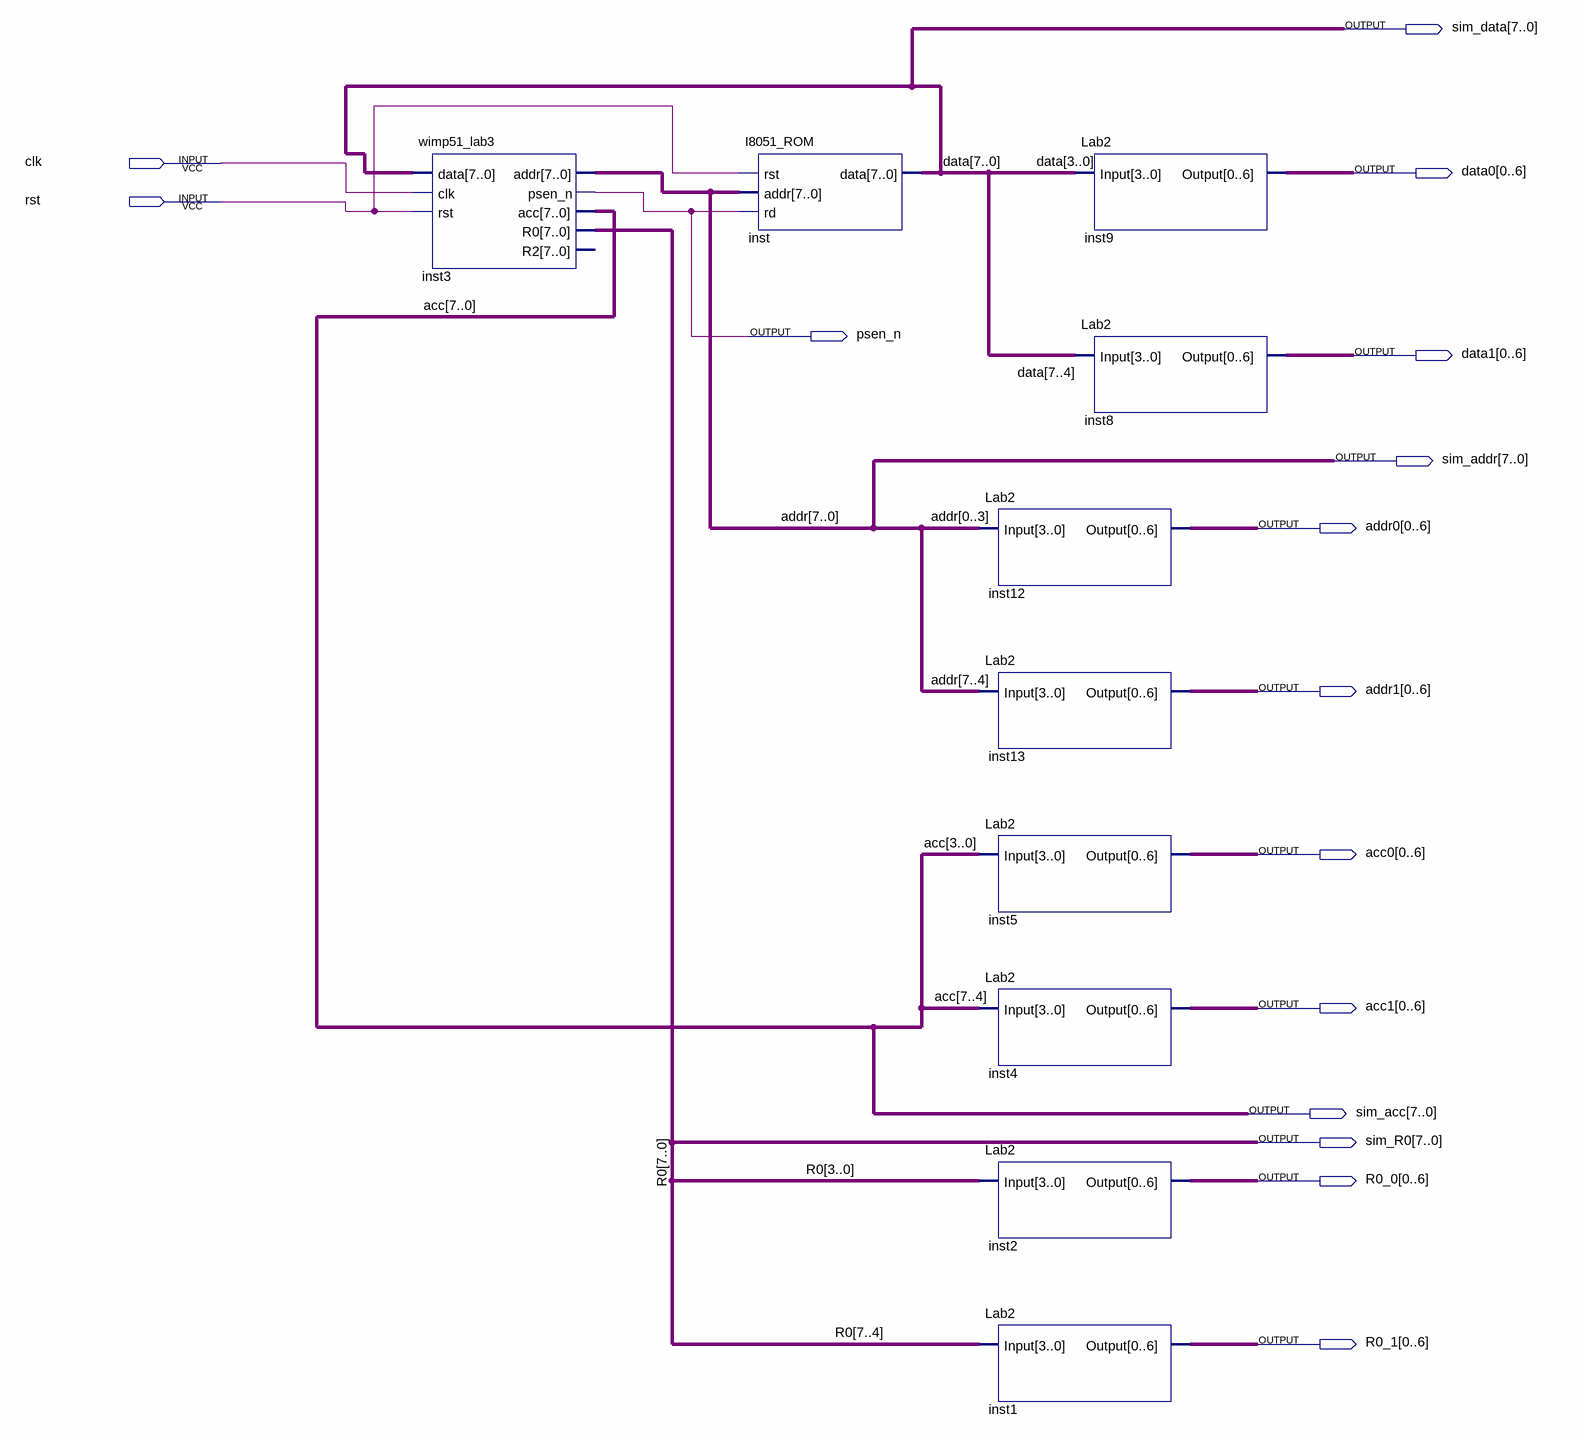
[diagram p0: schematic sheet]
// Quartus schematic TopLevel.bdf as structural Verilog: 10 symbols, 15 pins
module TopLevel (
  input  clk,
  input  rst,
  output [7:0] sim_data,
  output [0:6] data0,
  output psen_n,
  output [0:6] data1,
  output [7:0] sim_addr,
  output [0:6] addr0,
  output [0:6] addr1,
  output [0:6] acc0,
  output [0:6] acc1,
  output [7:0] sim_acc,
  output [7:0] sim_R0,
  output [0:6] R0_0,
  output [0:6] R0_1
);

  wimp51_lab3 inst3 (
    .data(sim_data), .clk(clk), .rst(rst), .addr(sim_addr), .psen_n(psen_n), .acc(sim_acc), .R0(sim_R0));  // open: R2
  I8051_ROM inst (.rst(rst), .addr(sim_addr), .rd(psen_n), .data(sim_data));
  Lab2 inst12 (.Input({sim_addr[0], sim_addr[1], sim_addr[2], sim_addr[3]}), .Output(addr0));
  Lab2 inst13 (.Input(sim_addr[7:4]), .Output(addr1));
  Lab2 inst5 (.Input(sim_acc[3:0]), .Output(acc0));
  Lab2 inst4 (.Input(sim_acc[7:4]), .Output(acc1));
  Lab2 inst2 (.Input(sim_R0[3:0]), .Output(R0_0));
  Lab2 inst1 (.Input(sim_R0[7:4]), .Output(R0_1));
  Lab2 inst9 (.Input(sim_data[3:0]), .Output(data0));
  Lab2 inst8 (.Input(sim_data[7:4]), .Output(data1));

  // Other names for the same wires on the sheet: data[7:0] = sim_data; acc[7:0] = sim_acc; addr[7:0] = sim_addr;
  //   R0[7:0] = sim_R0
endmodule
